# EAGLE design re1c002untcl-breakout (EAGLE 9.6.2)
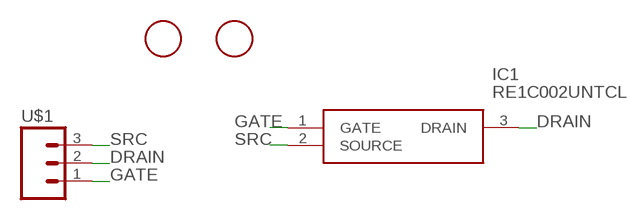
[diagram p0: schematic, sheet 1]

## Parts
IC1  RE1C002UNTCL  [SOT50P160X85-3N]
U$1  M03  [1X03_UDPI]
U$2  FIDUCIAL  [FIDUCIAL_1MM]
U$3  FIDUCIAL  [FIDUCIAL_1MM]

## Nets
DRAIN: IC1.3(DRAIN) U$1.2
GATE: IC1.1(GATE) U$1.1
SRC: IC1.2(SOURCE) U$1.3

## Library data of the parts
IC1 = transitors:RE1C002UNTCL: MOSFET 1.2V Drive Nch MOSFET Source: Datasheet <https://componentsearchengine.com/Datasheets/1/RE1C002UNTCL.pdf>; DESCRIPTION: MOSFET 1.2V Drive Nch MOSFET; HEIGHT: 0.85mm; MANUFACTURER_NAME: ROHM Semiconductor; MANUFACTURER_PART_NUMBER: RE1C002UNTCL; MOUSER_PART_NUMBER: 755-RE1C002UNTCL; MOUSER_PRICE-STOCK: https://www.mouser.com/Search/Refine.aspx?Keyword=755-RE1C002UNTCL
U$1 = connector:M03: Header 3 Standard 3-pin 0.1" header. Use with straight break away headers (SKU : PRT-00116), right angle break away headers (PRT-00553), swiss pins (PRT-00743), machine pins (PRT-00117), and female headers (PRT-00115). Molex polarized connector foot print use with SKU : PRT-08232 with associated crimp pins and housings.
U$2 U$3 = adafruit:FIDUCIAL: For use by pick and place machines to calibrate the vision/machine, 1mm By microbuilder.eu

## Board
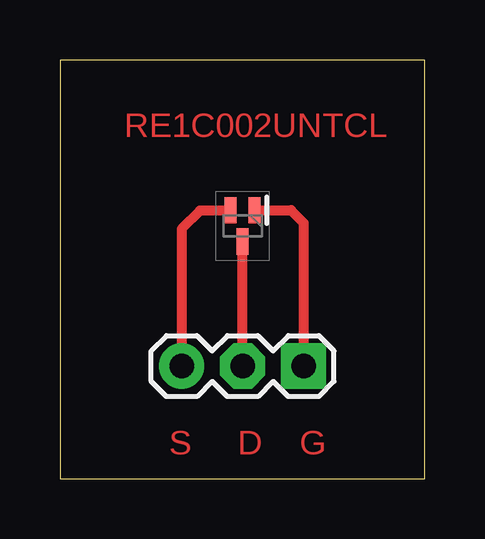
[diagram p1: board, top side]

Size 15.22 x 17.45 mm. Coordinates in mm from the lower left corner, seen from the top.
Outline: 0,0 15.22,0 15.22,17.45 0,17.45 0,0
Copper layers (1*16): Top 0.035mm / dielectric 1.5mm / Bottom 0.035mm
Design rules "default": minimum track width 6mil, minimum drill 0.35mm, track to track 6mil, track to pad 6mil, pad to pad 6mil, via to via 6mil, smd to smd 6mil, copper to edge 40mil, drill to drill 6mil, minimum pad ring 10mil, minimum via ring 8mil, stop-mask expansion 4mil, vias tented up to drill 0mil, thermal gap 10mil

### Footprints (pad centres in the part's own frame; a part is rotated, then mirrored left to right if it is on the bottom)
SOT50P160X85-3N = smd 1.1 x 0.5: 1 -0.65,0.5; 2 -0.65,-0.5; 3 0.65,0
1X03_UDPI = drill 1.016 pad 1.88 square: 1 0,0 | drill 1.016 pad 1.88 octagon: 2 2.54,0 | drill 1.016 pad 1.88: 3 5.08,0

### Placement (x,y rotation side)
IC1  7.62,10.54 270 top
U$1  10.16,4.7 180 top

### Tracks (layer width: path | path; a pad name or v marks a point on that pad's centre or on a via)
DRAIN
  Top 0.406: U$1.2 IC1.3
GATE
  Top 0.406: IC1.1 9.64,11.19 10.16,10.67 U$1.1
SRC
  Top 0.406: IC1.2 7.11,11.18 5.84,11.18 5.08,10.41 U$1.3

### Text on the board
Top: RE1C002UNTCL | S | D | G